# EAGLE design board1 (EAGLE 6.5.0)
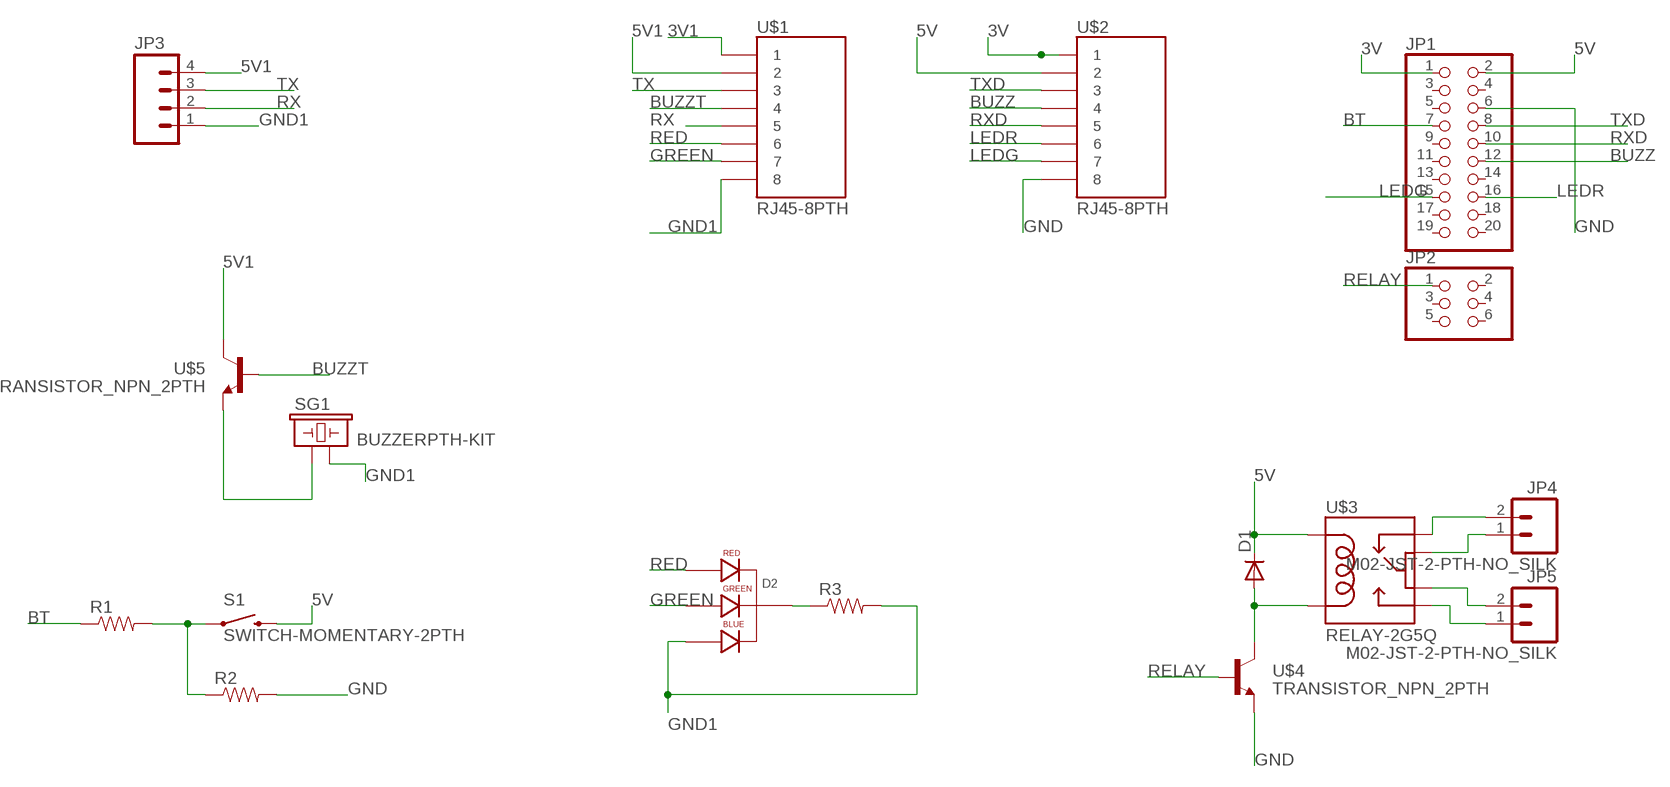
[diagram p0: schematic, sheet 1]

## Parts
D1  DIODEPTH  [DIODE-1N4001]
D2  LED-RGB-CC-THRUCLEAR  [LED-RGB-THRU]
JP1  PINHD-2X10  [2X10]
JP2  PINHD-2X3  [2X03]
JP3  M04PTH  [1X04]
JP4  M02-JST-2-PTH-NO_SILK  [JST-2-PTH-NS]
JP5  M02-JST-2-PTH-NO_SILK  [JST-2-PTH-NS]
R1  RESISTORPTH-1/4W  [AXIAL-0.4]
R2  RESISTORPTH-1/4W  [AXIAL-0.4]
R3  RESISTORPTH-1/4W  [AXIAL-0.4]
S1  SWITCH-MOMENTARY-2PTH  [TACTILE-PTH]
SG1  BUZZERPTH-KIT  [BUZZER-12MM-KIT]
U$1  RJ45-8PTH  [RJ45-8]
U$2  RJ45-8PTH  [RJ45-8]
U$3  RELAY-2G5Q  [RELAY-G5V]
U$4  TRANSISTOR_NPN_2PTH  [TO-92]
U$5  TRANSISTOR_NPN_2PTH  [TO-92]

## Nets
3V: JP1.1 U$2.1
3V1: U$1.1
5V: D1.C JP1.2 S1.3 U$2.2 U$3.2
5V1: JP3.4 U$1.2 U$5.1(C)
BT: JP1.7 R1.P$1
BUZZ: JP1.12 U$2.4
BUZZT: U$1.4 U$5.2(B)
GND: JP1.6 R2.P$2 U$2.8 U$4.3(E)
GND1: D2.4(BLUE_CATHODE) JP3.1 R3.P$2 SG1.- U$1.8
GREEN: D2.3(GREEN_CATHODE) U$1.7
LEDG: JP1.15 U$2.7
LEDR: JP1.16 U$2.6
N$1: R1.P$2 R2.P$1 S1.1
N$2: SG1.+ U$5.3(E)
N$3: D1.A U$3.9 U$4.1(C)
N$4: JP4.2 U$3.1
N$5: JP4.1 U$3.5
N$6: JP5.2 U$3.6
N$7: JP5.1 U$3.10
N$13: D2.2(CATHODE) R3.P$1
RED: D2.1(RED_CATHODE) U$1.6
RELAY: JP2.1 U$4.2(B)
RX: JP3.2 U$1.5
RXD: JP1.10 U$2.5
TX: JP3.3 U$1.3
TXD: JP1.8 U$2.3
Unconnected: JP1.3 JP1.4 JP1.5 JP1.9 JP1.11 JP1.13 JP1.14 JP1.17 JP1.18 JP1.19 JP1.20 JP2.2 JP2.3 JP2.4 JP2.5 JP2.6

## Library data of the parts
D1 = SparkFun-DiscreteSemi:DIODE: Diode These are standard reverse protection diodes and small signal diodes. SMA package can handle up to about 1A. SOD-323 can handle about 200mA. What the SOD-323 package when ordering, there are some mfgs out there that are 5-pin packages.
D2 = SparkFun-LED:LED-RGB-CC-THRU: RGB Through-hole common cathode LED SparkFun Storefront: COM-00105 (Clear) COM-09264 (Diffuse); PROD_ID: DIO-08418
JP1 = SparkFun-Connectors:PINHD-2X10: PIN HEADER
JP2 = SparkFun-Connectors:PINHD-2X3: PIN HEADER
JP3 = SparkFun-Connectors:M04: Header 4 Standard 4-pin 0.1" header. Use with straight break away headers (SKU : PRT-00116), right angle break away headers (PRT-00553), swiss pins (PRT-00743), machine pins (PRT-00117), and female headers (PRT-00115). Molex polarized connector foot print use with SKU : PRT-08231 with associated crimp pins and housings. 1MM SMD Version SKU: PRT-10208
JP4 JP5 = SparkFun-Connectors:M02: Standard 2-pin 0.1" header. Use with - straight break away headers ( PRT-00116) - right angle break away headers (PRT-00553) - swiss pins (PRT-00743) - machine pins (PRT-00117) - female headers (PRT-00115) Molex polarized connector foot print use with: PRT-08233 with associated crimp pins and housings. 2.54_SCREWTERM for use with PRT-10571. 3.5mm Screw Terminal footprints for PRT-08084 5mm Screw Terminal footprints for use with PRT-08433
R1 R2 = SparkFun-Resistors:RESISTOR: Resistor Basic schematic elements and footprints for 0603, 1206, and PTH resistors.
R3 = SparkFun-Passives:RESISTOR: Resistor Basic schematic elements and footprints for 0603, 1206, and PTH resistors.
S1 = SparkFun-Electromechanical:SWITCH-MOMENTARY-2: Various NO switches- pushbuttons, reed, etc
SG1 = SparkFun-Electromechanical:BUZZER: Buzzer 12mm Spark Fun Electronics SKU : Comp-Buzzer; PROD_ID: COMP-08253
U$1 U$2 = SparkFun-Connectors:RJ45-8: RJ45 Jack Simple RJ45, 8-pin connection - connector for common Cat5, Cat5e, and Cat6 Ethernet cables. Footprint not yet proven in production. Connector sku is PRT-00643; Breakout PCB sku is BOB-00716.
U$3 = SparkFun-Electromechanical:RELAY-2: SPDT relay (COM-00100)
U$4 U$5 = SparkFun-DiscreteSemi:TRANSISTOR_NPN_2: Alternate TO-92 NPN BJT

## Board
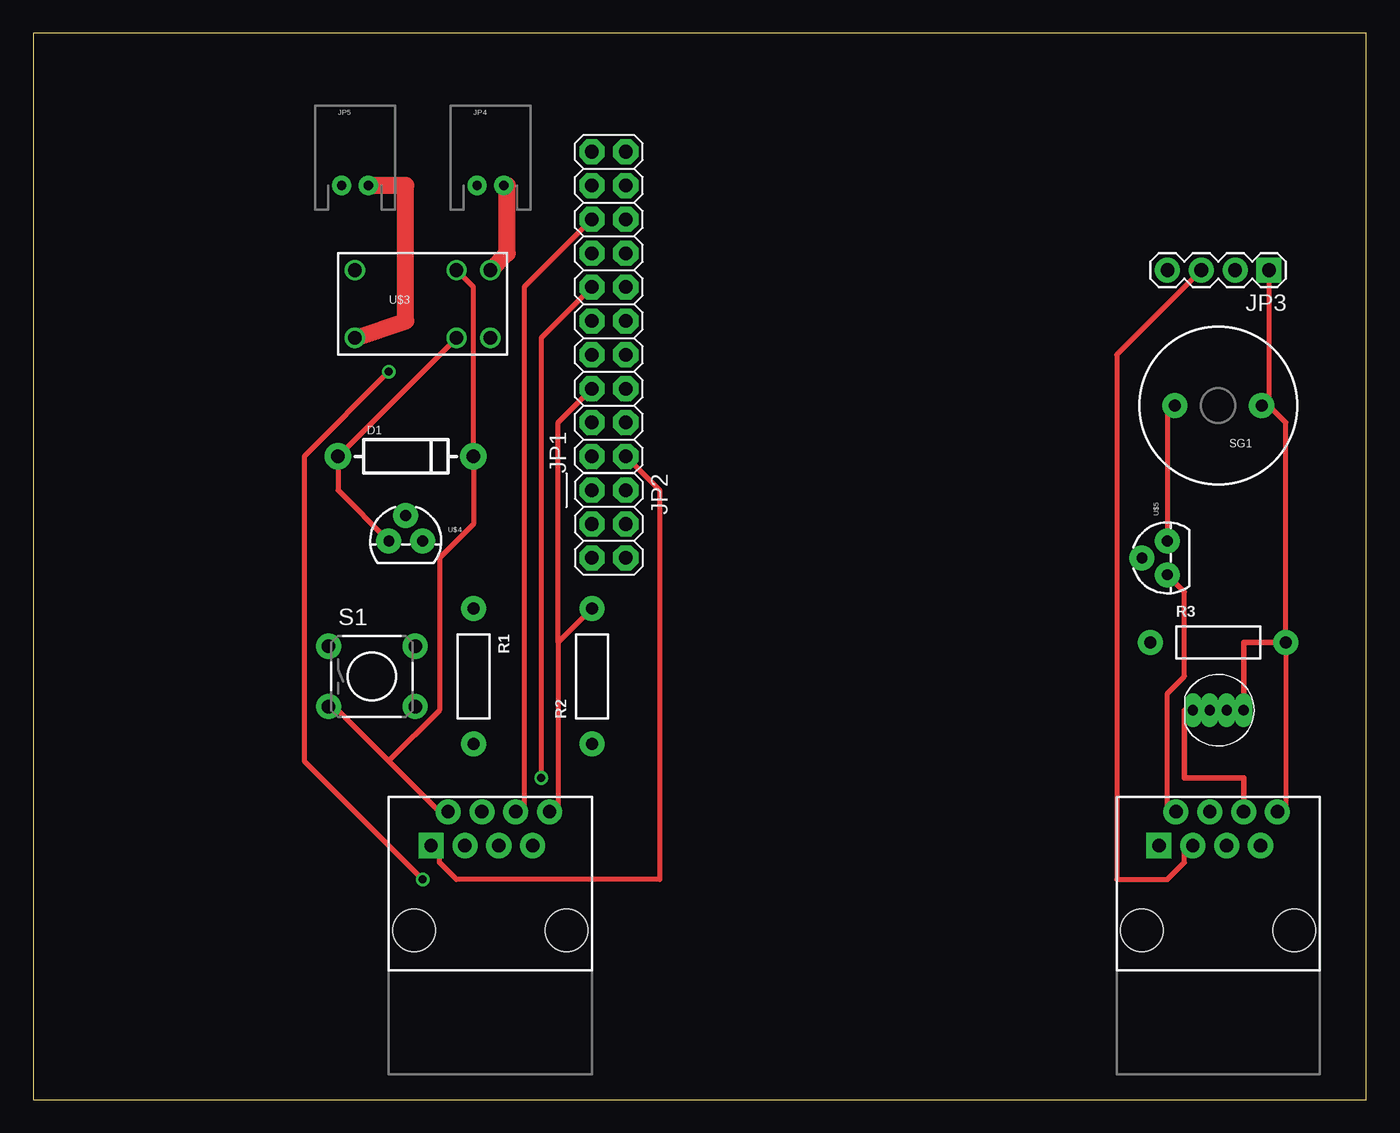
[diagram p1: board, top side]
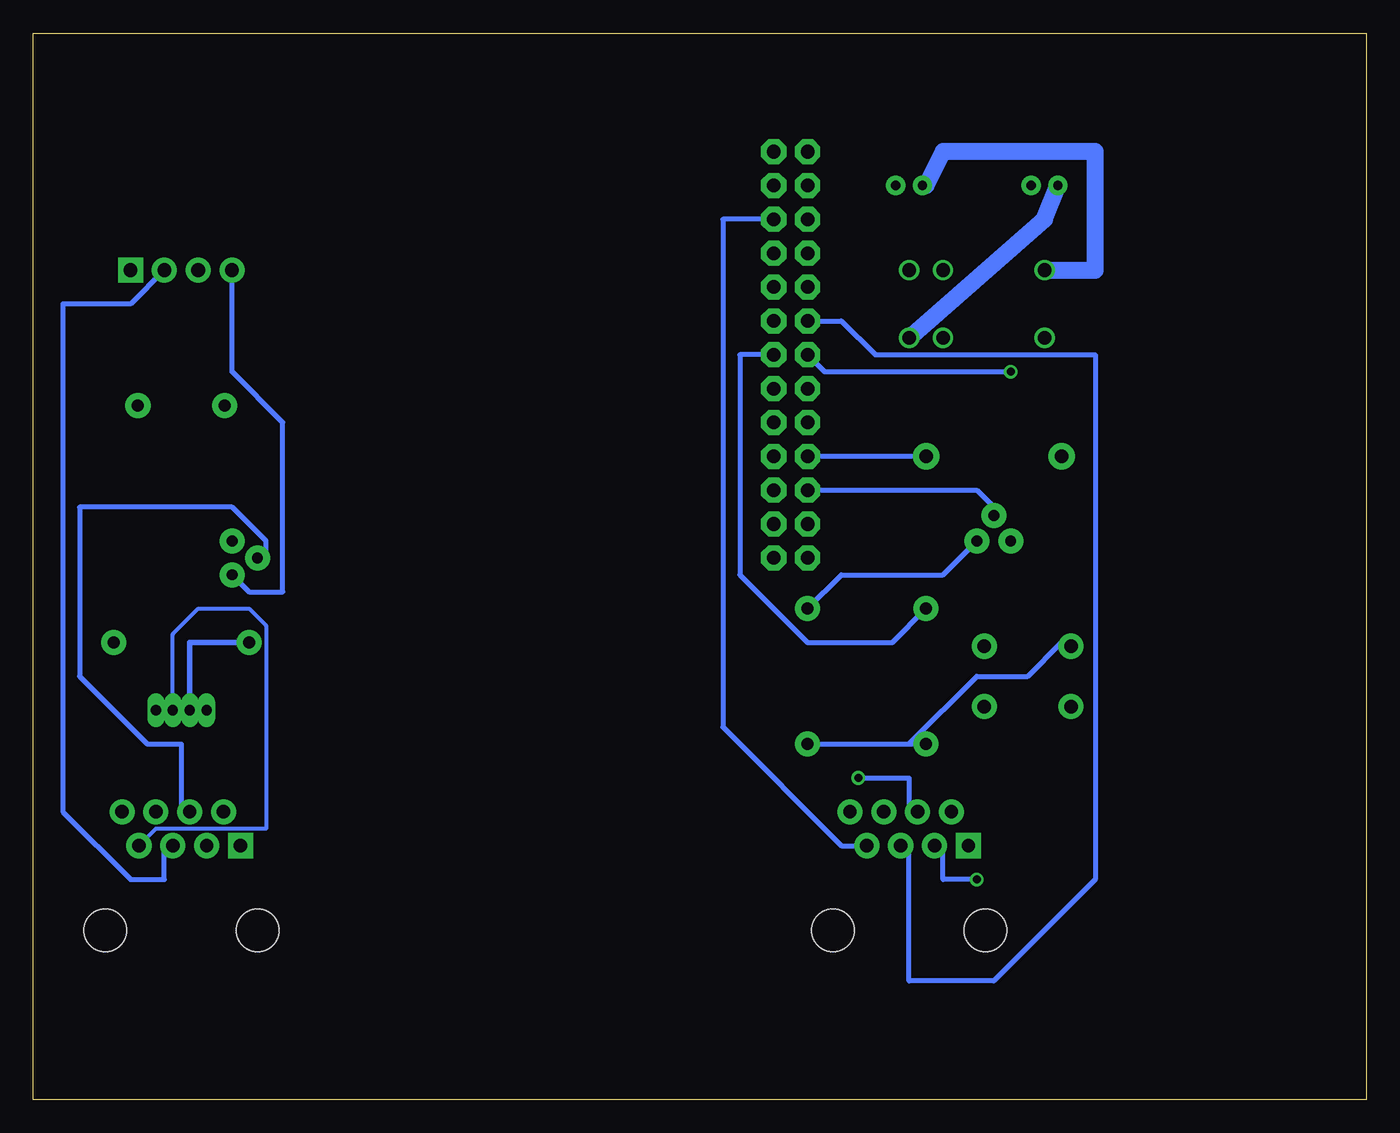
[diagram p2: board, bottom side, seen from below]

Size 100 x 80 mm. Coordinates in mm from the lower left corner, seen from the top.
Outline: 0,0 100,0 100,80 0,80 0,0
Copper layers (1*16): Top 0.035mm / dielectric 1.5mm / Bottom 0.035mm
Design rules "default *": minimum track width 15mil, minimum drill 24mil, track to track 10mil, track to pad 10mil, pad to pad 10mil, via to via 10mil, smd to smd 10mil, copper to edge 40mil, drill to drill 10mil, minimum pad ring 10mil, minimum via ring 8mil, stop-mask expansion 4mil, vias tented up to drill 0mil, thermal gap 10mil

### Footprints (pad centres in the part's own frame; a part is rotated, then mirrored left to right if it is on the bottom)
DIODE-1N4001 = drill 1 pad 1.981: A -5.08,0; C 5.08,0
LED-RGB-THRU = drill 0.762 pad 0.889 long: 1 1.905,0; 2 0.635,0; 3 -0.635,0; 4 -1.905,0
2X10 = drill 1.016 pad 1.88 octagon: 1 -11.43,-1.27; 2 -11.43,1.27; 3 -8.89,-1.27; 4 -8.89,1.27; 5 -6.35,-1.27; 6 -6.35,1.27; 7 -3.81,-1.27; 8 -3.81,1.27; 9 -1.27,-1.27; 10 -1.27,1.27; 11 1.27,-1.27; 12 1.27,1.27; 13 3.81,-1.27; 14 3.81,1.27; 15 6.35,-1.27; 16 6.35,1.27; 17 8.89,-1.27; 18 8.89,1.27; 19 11.43,-1.27; 20 11.43,1.27
2X03 = drill 1.016 pad 1.88 octagon: 1 -2.54,-1.27; 2 -2.54,1.27; 3 0,-1.27; 4 0,1.27; 5 2.54,-1.27; 6 2.54,1.27
1X04 = drill 1.016 pad 1.88 square: 1 0,0 | drill 1.016 pad 1.88: 2 2.54,0; 3 5.08,0; 4 7.62,0
JST-2-PTH-NS = drill 0.7 pad 1.448: 1 -1,0; 2 1,0
AXIAL-0.4 = drill 0.9 pad 1.88: P$1 -5.08,0; P$2 5.08,0
TACTILE-PTH = drill 1.016 pad 1.88: 1 -3.251,2.261; 2 3.251,2.261; 3 -3.251,-2.261; 4 3.251,-2.261
BUZZER-12MM-KIT = drill 0.9 pad 1.88: + 3.25,0; - -3.25,0
RJ45-8 = drill 1 pad 1.88 square: 1 -4.445,6.35 | drill 1 pad 1.88: 2 -3.175,8.89; 3 -1.905,6.35; 4 -0.635,8.89; 5 0.635,6.35; 6 1.905,8.89; 7 3.175,6.35; 8 4.445,8.89 | hole 3.2: -5.715,0; 5.715,0
RELAY-G5V = drill 1.016: 1 5.08,2.54; 2 2.54,2.54; 5 -5.08,2.54; 6 -5.08,-2.54; 9 2.54,-2.54; 10 5.08,-2.54
TO-92 = drill 0.813 pad 1.88: 1 -1.27,0; 2 0,1.905; 3 1.27,0

### Placement (x,y rotation side)
D1  27.94,48.26 0 top
D2  88.9,29.21 180 top
JP1  43.18,59.69 90 top
JP2  43.18,43.18 270 top
JP3  92.71,62.23 180 top
JP4  34.29,68.58 0 top
JP5  24.13,68.58 0 top
R1  33.02,31.75 270 top
R2  41.91,31.75 90 top
R3  88.9,34.29 0 top
S1  25.4,31.75 0 top
SG1  88.9,52.07 180 top
U$1  88.9,12.7 0 top
U$2  34.29,12.7 0 top
U$3  29.21,59.69 0 top
U$4  27.94,41.91 0 top
U$5  85.09,40.64 90 top

### Tracks (layer width: path | path; a pad name or v marks a point on that pad's centre or on a via)
3V
  Top 0.381: JP1.1 46.99,45.72 46.99,16.51 31.75,16.51 30.48,17.78 30.48,19.05 U$2.1
5V
  Top 0.381: 26.67,25.4 22.86,29.21 S1.3 | 26.67,25.4 30.48,21.59 U$2.2 | U$3.2 33.02,60.96 D1.C 33.02,43.18 30.48,40.64 30.48,29.21 26.67,25.4
  Bottom 0.381: D1.C JP1.2
5V1
  Top 0.381: U$5.1 86.36,38.1 86.36,31.75 85.09,30.48 85.09,21.59 U$1.2
  Bottom 0.381: JP3.4 85.09,54.61 81.28,50.8 81.28,38.1 83.82,38.1 U$5.1
BT
  Bottom 0.381: R1.P$1 35.56,34.29 41.91,34.29 46.99,39.37 46.99,55.88 JP1.7
BUZZ  (via drill 0.61)
  Top 0.381: v38.1,24.13 38.1,57.15 JP1.12
  Bottom 0.381: v38.1,24.13 34.29,24.13 34.29,21.59 U$2.4
BUZZT
  Bottom 0.381: U$1.4 88.9,21.59 88.9,26.67 91.44,26.67 96.52,31.75 96.52,44.45 85.09,44.45 82.55,41.91 82.55,40.64 U$5.2
GND
  Top 0.381: 39.37,34.29 39.37,21.59 U$2.8 | R2.P$2 39.37,34.29 | JP1.6 39.37,50.8 39.37,34.29
  Bottom 0.381: U$4.3 31.75,39.37 39.37,39.37 R2.P$2
GND1
  Top 0.381: JP3.1 92.71,52.07 | U$1.8 93.98,21.59 R3.P$2 93.98,50.8 92.71,52.07 | 92.71,52.07 SG1.-
  Top 0.406: R3.P$2 90.81,34.29 D2.4
GREEN
  Bottom 0.305: D2.3 89.53,34.92 87.63,36.83 83.82,36.83 82.55,35.56 82.55,20.32 90.81,20.32 U$1.7
LEDG
  Bottom 0.381: U$2.7 39.37,19.05 48.26,27.94 48.26,66.04 JP1.15
LEDR
  Top 0.381: JP1.16 36.83,60.96 36.83,21.59 U$2.6
N$1
  Bottom 0.381: R2.P$1 34.29,26.67 | 34.29,26.67 R1.P$2 | 34.29,26.67 29.21,31.75 25.4,31.75 22.86,34.29 S1.1
N$2
  Top 0.381: U$5.3 85.09,52.07 SG1.+
N$3
  Top 0.381: U$3.9 D1.A 22.86,45.72 U$4.1
N$4
  Top 0.381: 35.56,68.58 JP4.2
  Top 1.27: 35.56,68.58 35.56,63.5 U$3.1
N$5
  Bottom 0.381: 33.02,68.58 JP4.1
  Bottom 1.27: 33.02,68.58 31.75,71.12 20.32,71.12 20.32,62.23 U$3.5
N$6
  Top 1.27: U$3.6 27.94,58.42 27.94,68.58 JP5.2
N$7
  Bottom 1.27: U$3.10 24.13,66.04 JP5.1
N$13
  Bottom 0.406: R3.P$1 88.27,34.29 D2.2
RED
  Top 0.406: D2.1 86.36,29.21 86.36,24.13 90.81,24.13 U$1.6
RELAY
  Bottom 0.381: JP2.1 29.21,45.72 27.94,44.45 U$4.2
RX
  Bottom 0.381: JP3.2 92.71,59.69 97.79,59.69 97.79,21.59 92.71,16.51 90.17,16.51 90.17,19.05 U$1.5
RXD
  Bottom 0.381: JP1.10 39.37,58.42 36.83,55.88 20.32,55.88 20.32,16.51 27.94,8.89 34.29,8.89 34.29,19.05 U$2.5
TX
  Top 0.381: JP3.3 81.28,55.88 81.28,16.51 85.09,16.51 86.36,17.78 86.36,19.05 U$1.3
TXD  (via drill 0.61)
  Top 0.381: v29.21,16.51 20.32,25.4 20.32,48.26 v26.67,54.61
  Bottom 0.381: v29.21,16.51 31.75,16.51 31.75,19.05 U$2.3 | v26.67,54.61 40.64,54.61 JP1.8